# EAGLE design AD8495_x1_breakout (EAGLE 6.6.0)
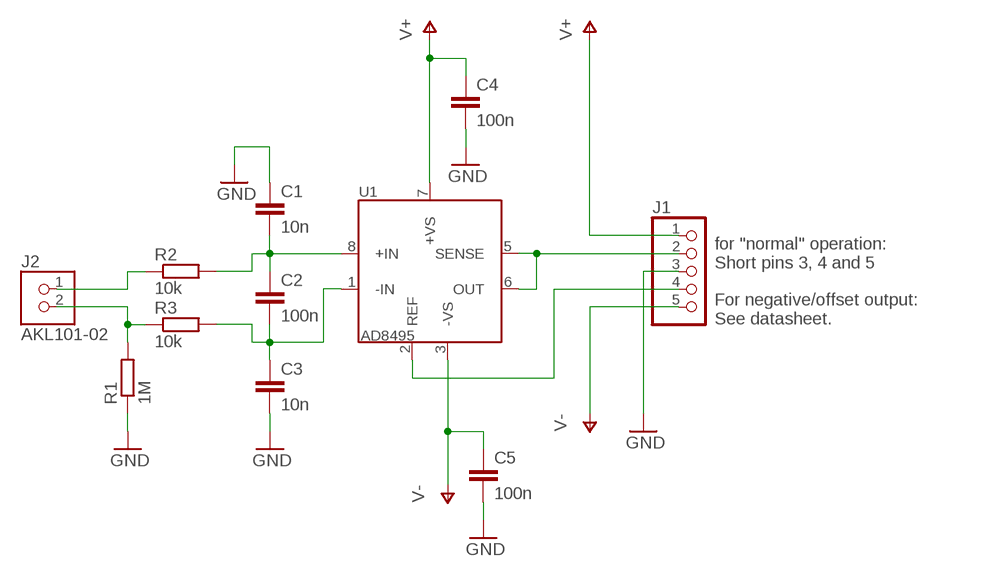
[diagram p0: schematic, sheet 1]

## Parts
C1  10n  C-EUC0805  [C0805]
C2  100n  C-EUC0805  [C0805]
C3  10n  C-EUC0805  [C0805]
C4  100n  C-EUC0805  [C0805]
C5  100n  C-EUC0805  [C0805]
J1  PINHD-1X5  [1X05]
J2  AKL101-02  [AKL101-02]
R1  1M  R-EUR0805  [R0805]
R2  10k  R-EUR0805  [R0805]
R3  10k  R-EUR0805  [R0805]
U1  AD8495RMZ  [MS_MSOP8]

## Nets
GND: C1.1 C3.2 C4.2 C5.2 J1.3 R1.1
N$1: C2.2 C3.1 R3.2 U1.1(-IN)
N$2: C1.2 C2.1 R2.2 U1.8(+IN)
N$3: J2.2 R1.2 R3.1
N$4: J2.1 R2.1
N$5: J1.4 U1.2(REF)
N$7: J1.2 U1.5(SENSE) U1.6(OUT)
V+: C4.1 J1.1 U1.7(+VS)
V-: C5.1 J1.5 U1.3(-VS)

## Notes on the sheet
- for "normal" operation:
  Short pins 3, 4 and 5
  
  For negative/offset output:
  See datasheet.

## Library data of the parts
C1-C5 = rcl_smd:C-EU
J1 = pinhead:PINHD-1X5: PIN HEADER
J2 = RIA:AKL101-02
R1-R3 = rcl_smd:R-EU
U1 = AnalogDevices:AD8495

## Net classes
0 default: clearance 0.205 mm

## Board
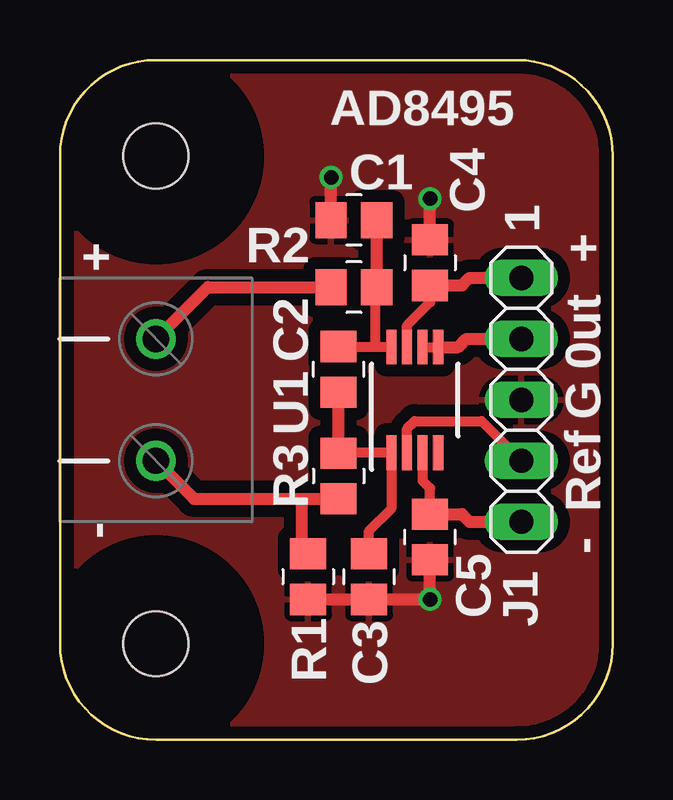
[diagram p1: board, top side]
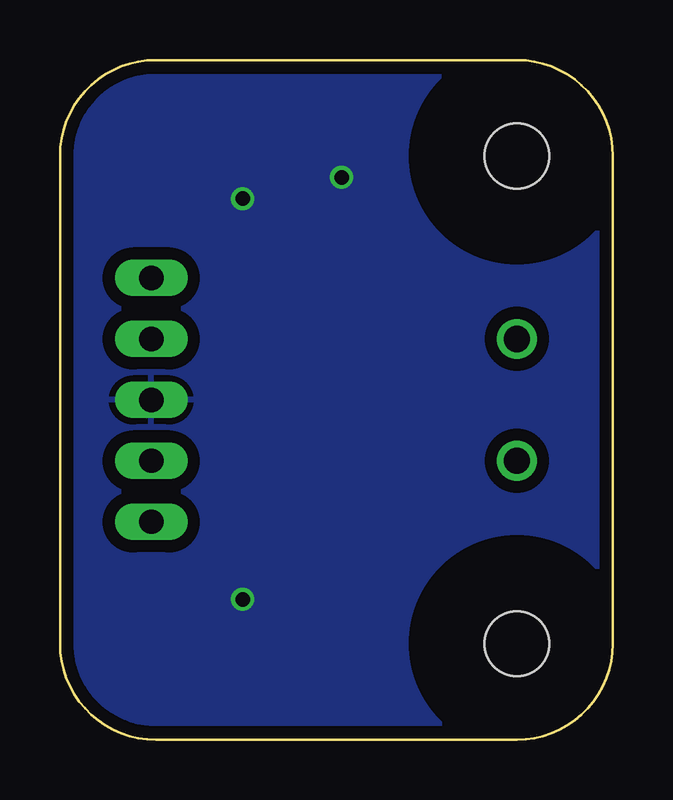
[diagram p2: board, bottom side, seen from below]

Size 23.05 x 28.32 mm. Coordinates in mm from the lower left corner, seen from the top.
Outline: 0,24.32 0,4 arc90 4,0 19.05,0 arc90 23.05,4 23.05,24.32 arc90 19.05,28.32 4,28.32 arc90 0,24.32
Copper layers (1*16): Top 0.0356mm / dielectric 1.5011mm / Bottom 0.0356mm
Design rules "LaenPCBOrder_OchPark": minimum track width 6mil, minimum drill 13mil, track to track 6mil, track to pad 6mil, pad to pad 6mil, via to via 6mil, smd to smd 6mil, copper to edge 15mil, drill to drill 6mil, minimum pad ring 7mil, minimum via ring 7mil, stop-mask expansion 3mil, vias tented up to drill 0mil, thermal gap 10mil
Holes 2.7 mm at 4,4 4,24.32
tRestrict: area 0,0 to 8,8; area 0,20.3 to 8,28.3
bRestrict: area 0,20.3 to 8,28.3; area 0,0 to 8,8

### Footprints (pad centres in the part's own frame; a part is rotated, then mirrored left to right if it is on the bottom)
C0805 = smd 1.3 x 1.5: 1 -0.95,0; 2 0.95,0
1X05 = drill 1.016 long: 1 -5.08,0; 2 -2.54,0; 3 0,0; 4 2.54,0; 5 5.08,0
AKL101-02 = drill 1.1: 1 0,0; 2 5.08,0
R0805 = smd 1.3 x 1.5: 1 -0.95,0; 2 0.95,0
MS_MSOP8 = smd 0.42 x 1.45: 1 -0.975,-2.2; 2 -0.325,-2.2; 3 0.325,-2.2; 4 0.975,-2.2; 5 0.975,2.2; 6 0.325,2.2; 7 -0.325,2.2; 8 -0.975,2.2

### Placement (x,y rotation side)
C1  12.25,21.65 0 top
C2  11.62,15.43 270 top
C3  12.89,6.79 270 top
C4  15.43,19.88 90 top
C5  15.43,8.45 270 top
J1  19.24,14.16 270 top
J2  4,16.7 270 top
R1  10.35,6.79 90 top
R2  12.25,18.86 0 top
R3  11.62,10.98 90 top
U1  14.79,14.16 0 top

### Tracks (layer width: path | path; a pad name or v marks a point on that pad's centre or on a via)
GND  (via drill 0.6)
  Top 0.508: R1.1 C3.2 v15.43,5.84 C5.2 | C4.2 v15.43,22.54 | C1.1 v11.3,23.43
  pour Bottom (isolate 0.508): 0,0 0,28.32 23.05,28.32 23.05,0
  pour Top (isolate 0.508): 0.19,0.19 0.19,28.13 23.05,28.13 23.05,0.19
N$1
  Top 0.356: 11.62,11.96 R3.2
  Top 0.406: 11.62,11.96 U1.1 13.82,9.63 12.89,8.7 C3.1
  Top 0.508: 11.62,11.96 C2.2
N$2
  Top 0.356: 11.62,16.36 C2.1 | R2.2 13.14,18.8
  Top 0.406: U1.8 13.14,16.36 | 13.14,16.36 11.62,16.36 | 13.14,18.8 13.14,16.36
  Top 0.508: C1.2 R2.2
N$3
  Top 0.457: R1.2 10.1,8
  Top 0.508: 10.1,10.04 5.58,10.04 J2.2 | 10.1,10.04 R3.1 | 10.1,8 10.1,10.04
N$4
  Top 0.508: R2.1 6.16,18.86 J2.1
N$5
  Top 0.406: U1.2 14.47,12.95 14.79,13.27 17.59,13.27 J1.4
N$7
  Top 0.406: U1.6 U1.5
  Top 0.508: U1.5 16.61,16.36 16.95,16.7 J1.2
V+
  Top 0.406: C4.1 15.43,18.22 14.47,17.26 U1.7
  Top 0.508: C4.1 16.77,18.93 17.08,19.24 J1.1
V-
  Top 0.406: U1.3 15.12,10.79 15.43,10.48 C5.1
  Top 0.508: C5.1 16.77,9.39 17.08,9.08 J1.5

### Text on the board
tPlace: AD8495 | + | + | 0ut | G | Ref | - | -
tNames: 1